# Altium schematic sheet rf_mods.SchDoc: CPU I/O Connectors
size B; Engineer: Michael J. Kelly; Organization: CSB540otn - Outernet; Address1: AM335x Compute Board; Address2: (C) 2015; Address3: See us on the Web:; Address4: http://outernet.is; DocumentNumber: 6; Revision: V1.0; SheetNumber: 6; SheetTotal: 9
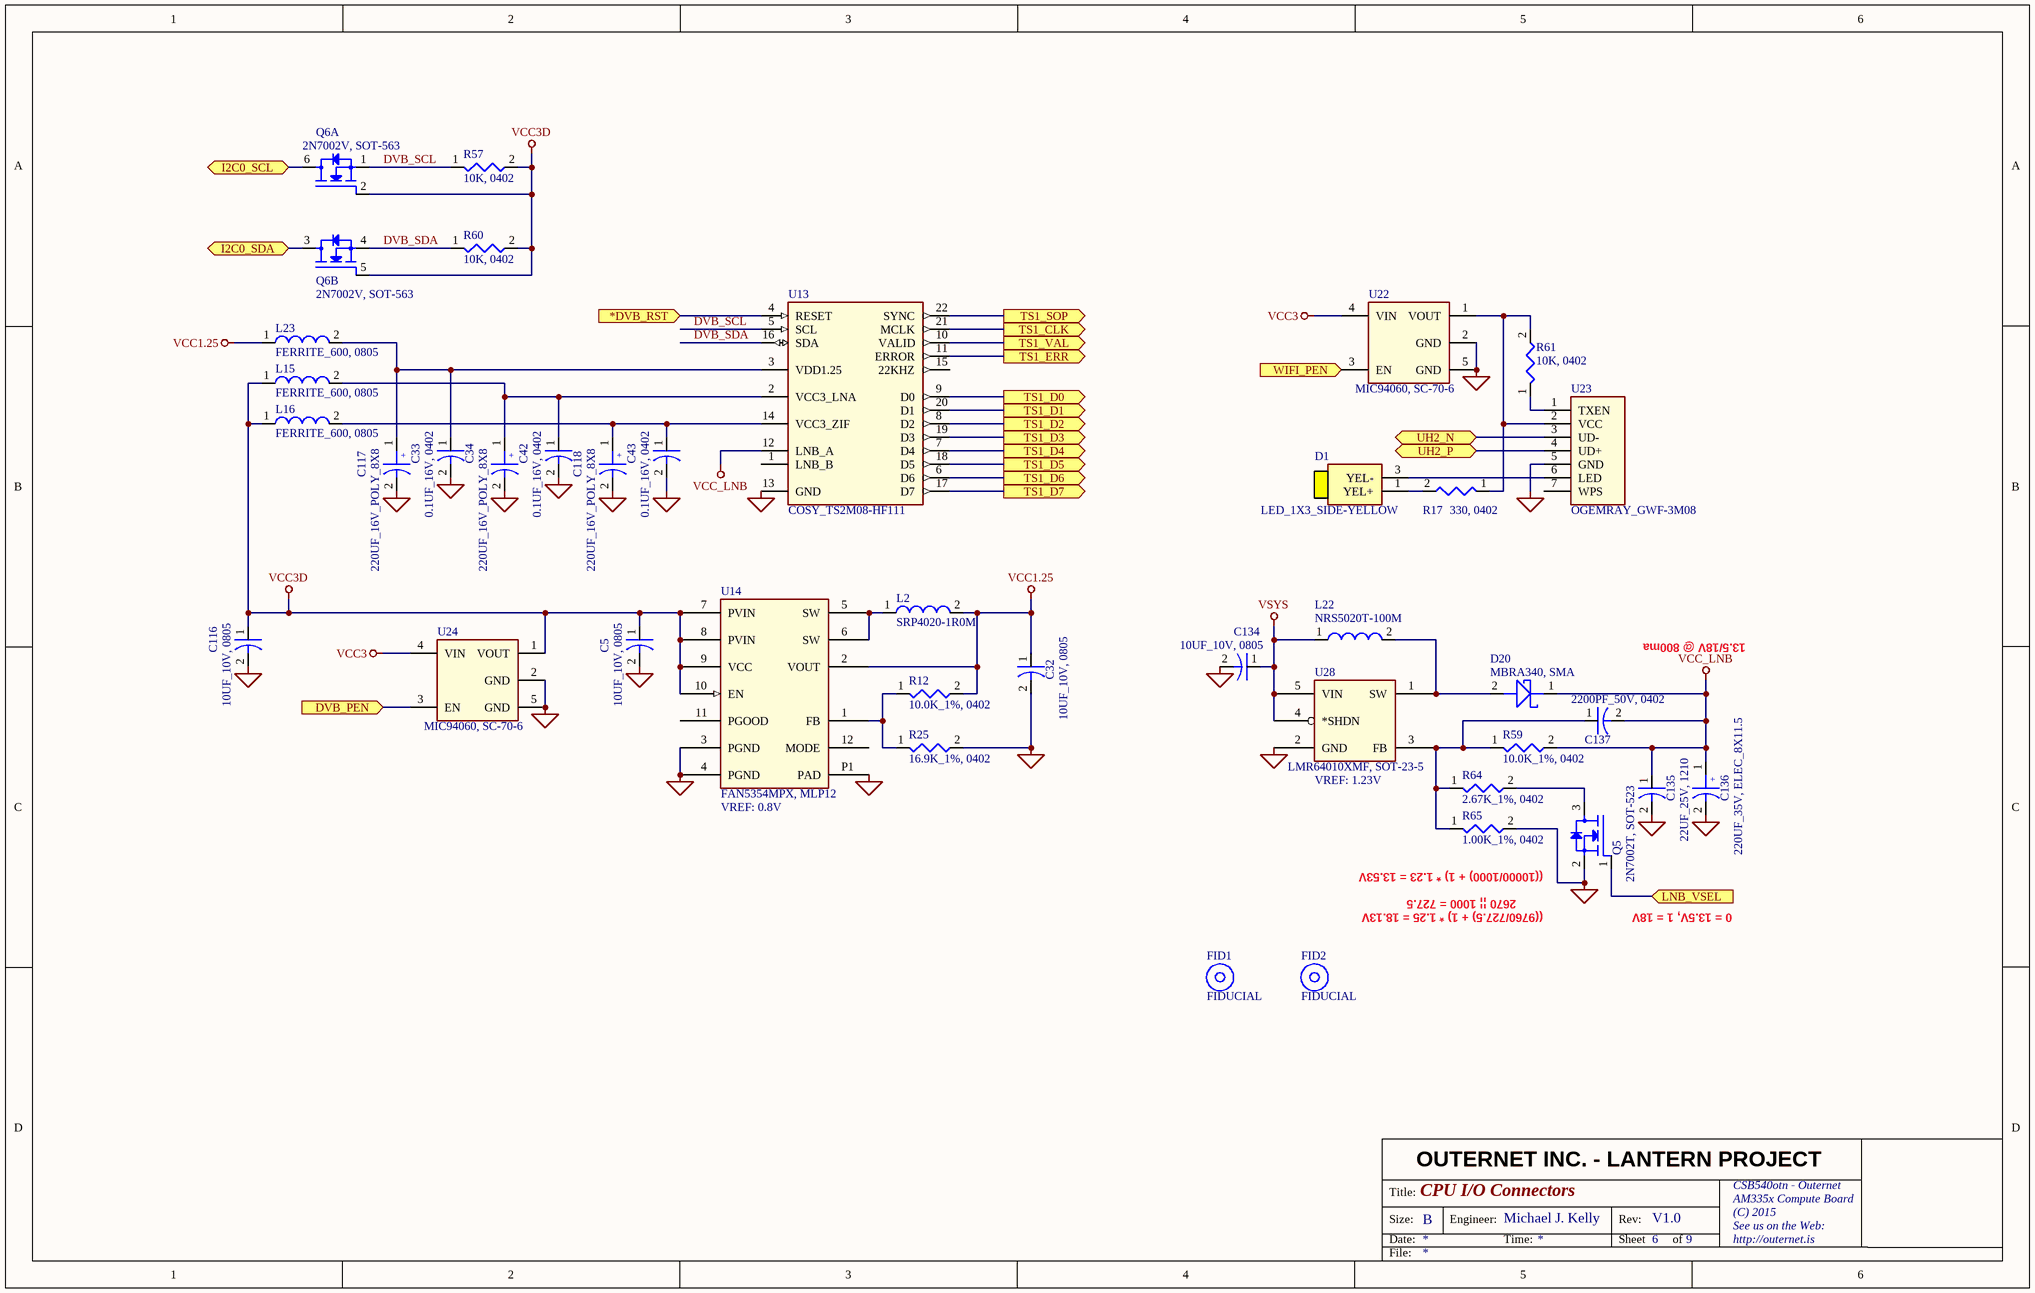
[diagram p0: rf_mods.SchDoc]

## Parts
C5  10UF_10V, 0805  [0805C]
C32  10UF_10V, 0805  [0805C]
C33  0.1UF_16V, 0402  [0402C]
C34  220UF_16V_POLY_8X8  [ELEC_8MM_8MM]
C42  0.1UF_16V, 0402  [0402C]
C43  0.1UF_16V, 0402  [0402C]
C116  10UF_10V, 0805  [0805C]
C117  220UF_16V_POLY_8X8  [ELEC_8MM_8MM]
C118  220UF_16V_POLY_8X8  [ELEC_8MM_8MM]
C134  10UF_10V, 0805  [0805C]
C135  22UF_25V, 1210  [1210C]
C136  220UF_35V, ELEC_8X11.5  [ELEC_8MM_11.5MM]
C137  2200PF_50V, 0402  [0402C]
D1  LED_1X3_SIDE-YELLOW  [LED_1X3_SIDE-YELLOW]
D20  MBRA340, SMA  [SMA]
FID1  FIDUCIAL  [FIDUCIAL]
FID2  FIDUCIAL  [FIDUCIAL]
L2  SRP4020-1R0M  [SRP4020]
L15  FERRITE_600, 0805  [0805L]
L16  FERRITE_600, 0805  [0805L]
L22  NRS5020T-100M  [NRS5020T]
L23  FERRITE_600, 0805  [0805L]
Q5  2N7002T, SOT-523  [SOT-523]
Q6  2N7002V, SOT-563  [SOT-563]  (parts A,B of 2)
R12  10.0K_1%, 0402  [0402R]
R17  330, 0402  [0402R]
R25  16.9K_1%, 0402  [0402R]
R57  10K, 0402  [0402R]
R59  10.0K_1%, 0402  [0402R]
R60  10K, 0402  [0402R]
R61  10K, 0402  [0402R]
R64  2.67K_1%, 0402  [0402R]
R65  1.00K_1%, 0402  [0402R]
U13  COSY_TS2M08-HF111  [TS2M08-HFF11]
U14  FAN5354MPX, MLP12  VREF: 0.8V  [mlp12]
U22  MIC94060, SC-70-6  [SOT-363/SC-70-6]
U23  OGEMRAY_GWF-3M08  [OGEMRAY_GWF-3M08-XX-T-2]
U24  MIC94060, SC-70-6  [SOT-363/SC-70-6]
U28  LMR64010XMF, SOT-23-5  VREF: 1.23V  [SOT-23-5]

## Ports
*DVB_RST (in), DVB_PEN (in), I2C0_SCL (bidir), I2C0_SDA (bidir), LNB_VSEL (in), TS1_CLK (out), TS1_D0 (out), TS1_D1 (out), TS1_D2 (out), TS1_D3 (out), TS1_D4 (out), TS1_D5 (out), TS1_D6 (out), TS1_D7 (out), TS1_ERR (out), TS1_SOP (out), TS1_VAL (out), UH2_N (bidir), UH2_P (bidir), WIFI_PEN (in)

## Nets
GND: C5.2 C32.2 C33.2 C34.2 C42.2 C43.2 C116.2 C117.2 C118.2 C134.2 C135.2 C136.2 Q5.2(SOURCE) R25.2 R65.2 U13.13(GND) U14.3(PGND) U14.4(PGND) U14.P1(PAD) U22.2(GND) U22.5(GND) U23.5(GND) U24.2(GND) U24.5(GND) U28.2(GND)
VCC1.25: C32.1 L2.2 L23.1 R12.2 U14.2(VOUT)
VCC3: U22.4(VIN) U24.4(VIN)
VCC3D: C5.1 C116.1 L15.1 L16.1 Q6.2 Q6.5 R57.2 R60.2 U14.7(PVIN) U14.8(PVIN) U14.9(VCC) U14.10(EN) U24.1(VOUT)
VCC_LNB: C135.1 C136.1 C137.2 D20.1(CATHODE) R59.2 U13.12(LNB_A)
VSYS: C134.1 L22.1 U28.4(*SHDN) U28.5(VIN)
*DVB_RST: U13.4(RESET) ; port *DVB_RST
DVB_PEN: U24.3(EN) ; port DVB_PEN
DVB_SCL: Q6.1 R57.1 U13.5(SCL)
DVB_SDA: Q6.4 R60.1 U13.16(SDA)
I2C0_SCL: Q6.6 ; port I2C0_SCL
I2C0_SDA: Q6.3 ; port I2C0_SDA
LNB_VSEL: Q5.1(GATE) ; port LNB_VSEL
TS1_CLK: U13.21(MCLK) ; port TS1_CLK
TS1_D0: U13.9(D0) ; port TS1_D0
TS1_D1: U13.20(D1) ; port TS1_D1
TS1_D2: U13.8(D2) ; port TS1_D2
TS1_D3: U13.19(D3) ; port TS1_D3
TS1_D4: U13.7(D4) ; port TS1_D4
TS1_D5: U13.18(D5) ; port TS1_D5
TS1_D6: U13.6(D6) ; port TS1_D6
TS1_D7: U13.17(D7) ; port TS1_D7
TS1_ERR: U13.11(ERROR) ; port TS1_ERR
TS1_SOP: U13.22(SYNC) ; port TS1_SOP
TS1_VAL: U13.10(VALID) ; port TS1_VAL
UH2_N: U23.3(UD-) ; port UH2_N
UH2_P: U23.4(UD+) ; port UH2_P
WIFI_PEN: U22.3(EN) ; port WIFI_PEN
NetC33_1: C33.1 C117.1 L23.2 U13.3(VDD1.25)
NetC34_1: C34.1 C42.1 L15.2 U13.2(VCC3_LNA)
NetC43_1: C43.1 C118.1 L16.2 U13.14(VCC3_ZIF)
NetC137_1: C137.1 R59.1 R64.1 R65.1 U28.3(FB)
NetD1_1: D1.1(YEL+) R17.2
NetD1_3: D1.3(YEL-) U23.6(LED)
NetD20_2: D20.2(ANODE) L22.2 U28.1(SW)
NetL2_1: L2.1 U14.5(SW) U14.6(SW)
NetQ5_3: Q5.3(DRAIN) R64.2
NetR12_1: R12.1 R25.1 U14.1(FB)
NetR17_1: R17.1 R61.2 U22.1(VOUT) U23.2(VCC)
NetR61_1: R61.1 U23.1(TXEN)

Not connected (* = marked no-connect by the designer): U13 1(LNB_B) 15(22KHZ); U14 11(PGOOD) 12(MODE); U23 7(WPS)

## Notes on the sheet
- 13.5/18V @ 800ma
- 2670 || 1000 = 727.5
- ((10000/1000) + 1) * 1.23 = 13.53V
- ((9760/727.5) + 1) * 1.25 = 18.13V
- 0 = 13.5V, 1 = 18V
- OUTERNET INC. - LANTERN PROJECT
- Title:
- Size:
- Date:
- B
- Engineer:
- Time:
- Rev:
- Sheet
- of
- File:
- (in symbol 220UF_16V_POLY_8X8) +
- (in symbol 220UF_35V, ELEC_8X11.5) +

## Library data of the parts
C5 C32 C116 C134 = 10UF_10V, 0805: CAP - 0805 PKG
C33 C42 C43 = 0.1UF_16V, 0402: CAP - 0402 PKG
C34 C117 C118 = 220UF_16V_POLY_8X8: CAP - ELEC_POLY, 8mm x 8mm x 3.5mm
C135 = 22UF_25V, 1210: CAP - 1210 PKG
C136 = 220UF_35V, ELEC_8X11.5: CAP - ELEC, 8mm x 11.5mm x 3.5mm
C137 = 2200PF_50V, 0402: CAP - 0402 PKG
D1 = LED_1X3_SIDE-YELLOW: LED - SIDEVIEW, SMT, YELLOW
D20 = MBRA340, SMA: DIODE - POWER, SCHOTTKY, 40V, 3A
FID1 FID2 = FIDUCIAL: MISC - 75mm/35mm FIDUCIAL
L2 = SRP4020-1R0M: INDUCTOR - 1.0UH, 5/6A, 4MM x 4MM x 2MM, 22mohm
L15 L16 L23 = FERRITE_600, 0805: FERRITE BEAD - 600 OHM, 2A, 0805 PKG
L22 = NRS5020T-100M: INDUCTOR - 10UH, 1.3A/1.45A, 5MM x 5MM x 2MM
Q5 = 2N7002T, SOT-523: N-FET - 60V, 500ma @ 10V, Vgs(th) 2V
Q6 = 2N7002V, SOT-563: N-FET - DUAL, 60V, 500ma @ 10V, Vgs(th) 2V
R12 R59 = 10.0K_1%, 0402: RES - 0402 PKG
R17 = 330, 0402: RES - 0402 PKG
R25 = 16.9K_1%, 0402: RES - 0402 PKG
R57 R60 R61 = 10K, 0402: RES - 0402 PKG
R64 = 2.67K_1%, 0402: RES - 0402 PKG
R65 = 1.00K_1%, 0402: RES - 0402 PKG
U13 = COSY_TS2M08-HF111: RF - MODULE, DVB-S2 TUNER/DEMODULATOR
U14 = FAN5354MPX, MLP12: SWITCHER - 270ua Iq, 3A, 2.7V TO 5.5V IN, 0.8V TO VIN OUT
U22 U24 = MIC94060, SC-70-6: IC - POWER SWITCH, 1.7V - 5.5V @ 2A, HIGH TRUE
U23 = OGEMRAY_GWF-3M08: MODULE - WIFI, RALINK RT5370 802.11b/g/n
U28 = LMR64010XMF, SOT-23-5: SWITCHER - BOOST, 1ma Iq, 2.7V TO 14V IN, VIN TO 40V OUT